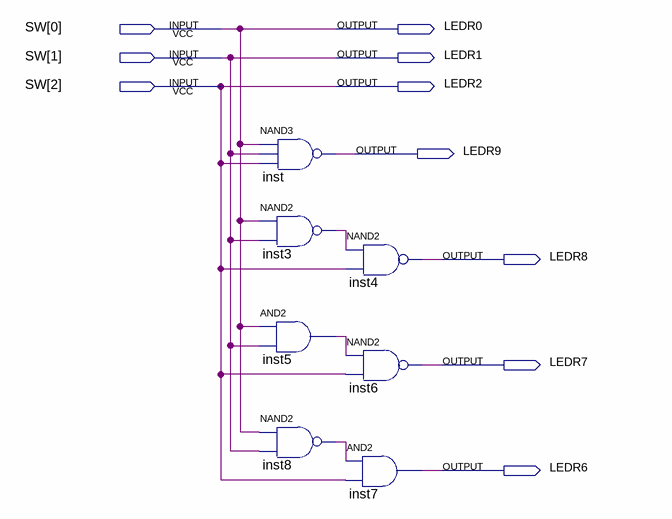
[diagram p0: schematic sheet]
// Quartus schematic Lab2_Part1.bdf as structural Verilog: 7 symbols, 10 pins
module Lab2_Part1 (
  input  [2:0] SW,
  output LEDR0,
  output LEDR1,
  output LEDR2,
  output LEDR9,
  output LEDR8,
  output LEDR7,
  output LEDR6
);

  wire inst3_out, inst5_out, inst8_out;

  nand inst (LEDR9, SW[0], SW[1], SW[2]);
  nand inst3 (inst3_out, SW[0], SW[1]);
  and inst5 (inst5_out, SW[0], SW[1]);
  nand inst8 (inst8_out, SW[0], SW[1]);
  nand inst4 (LEDR8, inst3_out, SW[2]);
  nand inst6 (LEDR7, inst5_out, SW[2]);
  and inst7 (LEDR6, inst8_out, SW[2]);

  assign LEDR0 = SW[0];
  assign LEDR1 = SW[1];
  assign LEDR2 = SW[2];
endmodule
